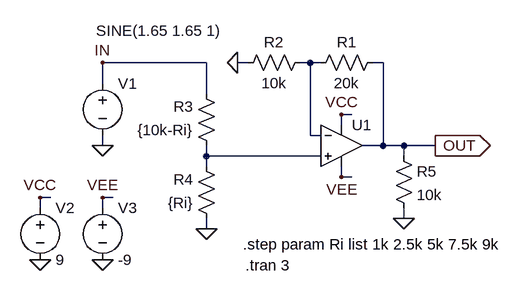
[diagram p0: schematic DASS01_CV_Amp.asc]
DASS01_CV_Amp.asc, the LTspice schematic file:
Version 4
SHEET 1 880 680
WIRE 16 16 -144 16
WIRE 80 16 64 16
WIRE 176 16 160 16
WIRE 192 16 176 16
WIRE 288 16 272 16
WIRE -144 48 -144 16
WIRE 16 64 16 16
WIRE 240 96 224 96
WIRE 224 112 224 96
WIRE 176 128 176 16
WIRE 192 128 176 128
WIRE -144 144 -144 128
WIRE 288 144 288 16
WIRE 288 144 256 144
WIRE 320 144 288 144
WIRE 368 144 320 144
WIRE 16 160 16 144
WIRE 192 160 16 160
WIRE 320 160 320 144
WIRE 16 176 16 160
WIRE 224 192 224 176
WIRE 240 192 224 192
WIRE -224 224 -240 224
WIRE -128 224 -144 224
WIRE -240 240 -240 224
WIRE -144 240 -144 224
WIRE 320 256 320 240
WIRE 16 272 16 256
FLAG 224 96 VCC
FLAG 64 16 0
FLAG 16 272 0
FLAG -144 144 0
FLAG -144 16 IN
FLAG 368 144 OUT
IOPIN 368 144 Out
FLAG 320 256 0
FLAG -240 320 0
FLAG -240 224 VCC
FLAG -144 320 0
FLAG -144 224 VEE
FLAG 224 192 VEE
SYMBOL Opamps\\UniversalOpamp2 224 144 R0
SYMATTR InstName U1
SYMBOL res 288 0 R90
WINDOW 0 0 56 VBottom 2
WINDOW 3 32 56 VTop 2
SYMATTR InstName R1
SYMATTR Value 20k
SYMBOL res 176 0 R90
WINDOW 0 0 56 VBottom 2
WINDOW 3 32 56 VTop 2
SYMATTR InstName R2
SYMATTR Value 10k
SYMBOL res 32 160 R180
WINDOW 0 36 76 Left 2
WINDOW 3 36 40 Left 2
SYMATTR InstName R3
SYMATTR Value {10k-Ri}
SYMBOL res 32 272 R180
WINDOW 0 36 76 Left 2
WINDOW 3 36 40 Left 2
SYMATTR InstName R4
SYMATTR Value {Ri}
SYMBOL voltage -144 32 R0
WINDOW 3 -10 -65 Left 2
WINDOW 123 0 0 Left 2
WINDOW 39 0 0 Left 2
SYMATTR InstName V1
SYMATTR Value SINE(1.65 1.65 1)
SYMBOL res 304 144 R0
SYMATTR InstName R5
SYMATTR Value 10k
SYMBOL voltage -240 224 R0
WINDOW 123 0 0 Left 2
WINDOW 39 0 0 Left 2
SYMATTR InstName V2
SYMATTR Value 9
SYMBOL voltage -144 224 R0
WINDOW 123 0 0 Left 2
WINDOW 39 0 0 Left 2
SYMATTR InstName V3
SYMATTR Value -9
TEXT 72 296 Left 2 !.step param Ri list 1k 2.5k 5k 7.5k 9k
TEXT 76 328 Left 2 !.tran 3

The netlist it stands for:
* DASS01_CV_Amp.asc
XU1 N002 N001 VCC VEE OUT level.2 Avol=1Meg GBW=10Meg Slew=10Meg ilimit=25m rail=0 Vos=0 phimargin=45 en=0 enk=0 in=0 ink=0 Rin=500Meg  ; pins IN+ IN- V+ V- OUT
R1 OUT N001 20k
R2 N001 0 10k
R3 N002 IN {10k-Ri}
R4 0 N002 {Ri}
V1 IN 0 SINE(1.65 1.65 1)
R5 OUT 0 10k
V2 VCC 0 9
V3 VEE 0 -9
.step param Ri list 1k 2.5k 5k 7.5k 9k
.tran 3
.lib UniversalOpamps2.sub
.backanno
.end